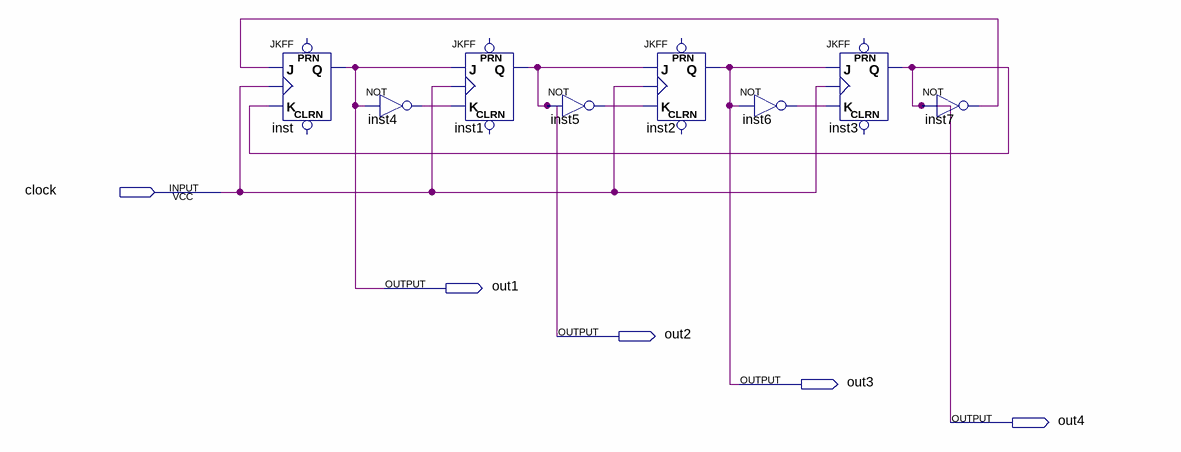
[diagram p0: schematic sheet]
// Quartus schematic question57.bdf as structural Verilog: 8 symbols, 5 pins
module question57 (
  input  clock,
  output out1,
  output out2,
  output out3,
  output out4
);

  wire inst4_out, inst5_out, inst6_out, inst7_out;

  JKFF inst (.K(out4), .J(inst7_out), .CLK(clock), .Q(out1));  // open: PRN, CLRN
  not inst4 (inst4_out, out1);
  JKFF inst1 (.K(inst4_out), .J(out1), .CLK(clock), .Q(out2));  // open: PRN, CLRN
  not inst5 (inst5_out, out2);
  JKFF inst2 (.K(inst5_out), .J(out2), .CLK(clock), .Q(out3));  // open: PRN, CLRN
  not inst6 (inst6_out, out3);
  JKFF inst3 (.K(inst6_out), .J(out3), .CLK(clock), .Q(out4));  // open: PRN, CLRN
  not inst7 (inst7_out, out4);
endmodule
